# Altium schematic sheet Protection Circuit 24V.SchDoc
size A; SheetNumber: 3; SheetTotal: 3
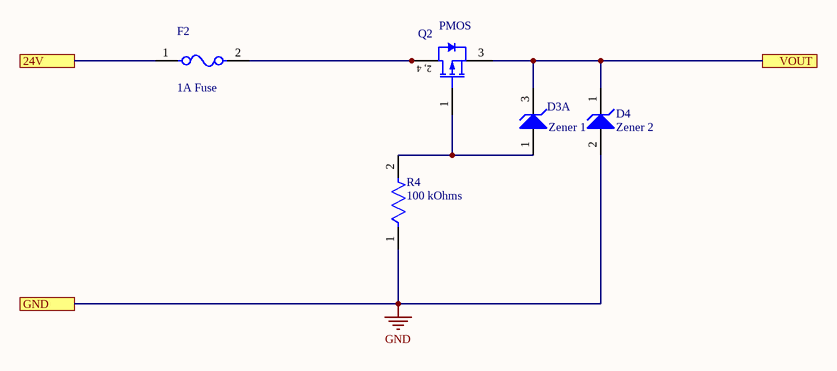
[diagram p0: Protection Circuit 24V.SchDoc]

## Parts
D3  Zener 1  [ONSC-SOT-23-3-318-08_V]  (part A of 2)
D4  Zener 2  [ONSC-SMB-2-403A-03_H_V]
F2  1A Fuse  [FP-0603SFS-MFG]
Q2  PMOS  [FAIR-SOT223-4_V]
R4  100 kOhms  [FP-CR0805-MFG]

## Ports
24V, GND, VOUT

## Nets
GND: D4.2(A) R4.1 ; port GND
24V: F2.1 ; port 24V
VOUT: D3.3(K) D4.1(K) Q2.3(SOURCE) ; port VOUT
NetD3_1: D3.1(A) Q2.1(GATE) R4.2
NetF2_2: F2.2 Q2.2(DRAIN) Q2.4(DRAIN)

## Notes on the sheet
- (in symbol CMP-2000-06838-1) 2, 4

## Library data of the parts
D3 = CMP-1060-01182-1: Zener Voltage Regulator, 225 mW, 3-Pin SOT-23, Pb-Free, Tape and Reel; PartNumber: MMBZ5245BLT3G; Manufacturer: On Semiconductor; VZ Typ (V): 15; ComponentLink3URL: http://www.onsemi.cn/pub_link/Collateral/318-08.PDF; ComponentLink1URL: http://www.onsemi.com/; PackageVersion: Rev. AP, 11/2009; ComponentLink2Description: Datasheet; ComponentLink2URL: http://www.onsemi.cn/pub_link/Collateral/MMBZ5221BLT1-D.PDF; Packing: Tape and Reel; RoHS: Pb-Free; ComponentLink1Description: Manufacturer URL; PackageReference: SOT-23-3-318-08; PackageDescription: 3-Pin Small Outline Transistor, Body 2.92 x 1.3 mm, Pitch 0.95 mm; DatasheetVersion: Rev. 12; Mounting Technology: Surface Mount; ComponentLink3Description: Package Specification
D4 = CMP-1060-00141-1: 3 W Zener Voltage Regulator, 2-Pin SMB, Pb-Free, Tape and Reel; Manufacturer: On Semiconductor; PartNumber: 1SMB5934BT3G; VZ Typ (V): 24; PackageReference: SMB-2-403A-03_H; RoHS: Pb-Free; ComponentLink3URL: http://www.onsemi.com/pub_link/Collateral/1SMB5913BT3-D.PDF; ComponentLink2URL: http://www.onsemi.com/pub_link/Collateral/1SMB5913BT3-D.PDF; ComponentLink3Description: Package Specification; Packing: Tape and Reel; DatasheetVersion: Rev. 8; ComponentLink2Description: Datasheet; ComponentLink1URL: http://www.onsemi.com/; ComponentLink1Description: Manufacturer URL; Mounting Technology: Surface Mount; PackageDescription: 2-Pin Small Molded Package, J-Bend Lead, Body 4.33 x 3.625 mm; PackageVersion: Rev. H, 05/2011
F2 = CMP-08605-000034-1: FUSE BOARD MOUNT 1A 32VDC 0603; Manufacturer Part Number: 0603SFS100F/32-2; Manufacturer: Littelfuse; Resistance: 0.2Ω; Fuse Interrupt Dc Current: 50A; Max Fuse Dc Voltage: 32V; Fuse I2T: 0.093A2Sec; Fuse Blow Speed: Slow; Value: 0.2Ω; Device Class L1: Circuit Protection; Device Class L3: unset; Category: Fuse; Temperature Range High: +125°C; ComponentLink2Description: Datasheet; Automotive: No; Device Class L2: Fuses; Lead Free: Yes; Fuse Current: 1A; Temperature: -55°C to +125°C; Digikey Description: FUSE BOARD MOUNT 1A 32VDC 0603; ComponentLink2URL: https://www.littelfuse.com/~/media/electronics/datasheets/fuses/littelfuse_fuse_sfs_datasheet.pdf.pdf; Octopart: https://octopart.com/0603sfs100f%2F32-2-littelfuse-74214378; Voltage Rating: 32V; RoHS: TRUE; Package: 0603SFS; Height: 0.95mm; Ipc Land Pattern Name: CAPC16080X80; Temperature Range Low: -55°C
Q2 = CMP-2000-06838-1: P-Channel Enhancement Mode Field Effect Transistor, 60 V, 2.5 A, -55 to 150 degC, 4-Pin SOT223, RoHS, Tape and Reel; Manufacturer: Fairchild Semiconductor; Drain-Source On Resistance-Max: 300mO; Qg Gate Charge: 15nC; Rated Power Dissipation: 3W; Drain-to-Source Voltage [Vdss]: 60V; Package Version: Rev. 3, 07/2016; Package Reference: SOT223-4; Package URL: https://www.fairchildsemi.com.cn/package-drawings/MA/MA04A.pdf; Datasheet URL: http://www.mouser.com/ds/2/149/NDT2955-116189.pdf; Manufacturer URL: https://www.fairchildsemi.com/; Channel Type: P-Channel; Mounting Technology: SurfaceMount; Package Description: 4-Pin Small Outline Transistor, Body 6.45 x 3.5 mm, Pitch 2.3 mm; Datasheet Version: Rev. 1.4, 04/2015
R4 = CMP-07231-001707-1: Thick Film Chip Resistors 0805 100kΩ 0.125W 5% 200ppm/°C; Power Rating: 125mW; Voltage Rating: 150V; Resistance: 100kR; Case Code (Metric): 2012; Case Code (Imperial): 0805; Temperature Coefficient: 200ppm/°C; Mount: Surface Mount; Tolerance: 5%; Radiation Hardening: No; Military Standard: Not; Contact Plating: Tin; Number of Terminations: 2; Packaging: Tape and Reel; Thickness: 508um; Length: 0.079inch; Depth: 1.25mm; Min Operating Temperature: -55°C; Features: Moisture Resistant; Max Operating Temperature: 155°C; Width: 0.049inch; Package Quantity: 10000; Termination: SMD/SMT; Composition: Thick Film; Max Power Dissipation: 125mW; Height: 0.024inch; Case/Package: 0805